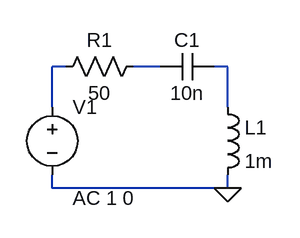
[diagram p0: schematic fig3.asc]
fig3.asc, the LTspice schematic file:
Version 4.1
SHEET 1 880 680
WIRE 48 64 32 64
WIRE 160 64 128 64
WIRE 240 64 224 64
WIRE 32 112 32 64
WIRE 240 112 240 64
WIRE 32 208 32 192
WIRE 240 208 240 192
WIRE 240 208 32 208
FLAG 240 208 0
SYMBOL voltage 32 96 R0
WINDOW 123 24 124 Left 2
WINDOW 39 0 0 Left 0
SYMATTR InstName V1
SYMATTR Value ""
SYMATTR Value2 AC 1 0
SYMBOL res 144 48 R90
WINDOW 0 0 56 VBottom 2
WINDOW 3 32 56 VTop 2
SYMATTR InstName R1
SYMATTR Value 50
SYMBOL cap 224 48 R90
WINDOW 0 0 32 VBottom 2
WINDOW 3 32 32 VTop 2
SYMATTR InstName C1
SYMATTR Value 10n
SYMBOL ind 224 96 R0
SYMATTR InstName L1
SYMATTR Value 1m
SYMATTR SpiceLine Rser=0

The netlist it stands for:
* fig3.asc
V1 N001 0 AC 1 0
R1 N002 N001 50
C1 N003 N002 10n
L1 N003 0 1m Rser=0
.backanno
.end